# EAGLE design viewer_rev2 (EAGLE 9.0.1)
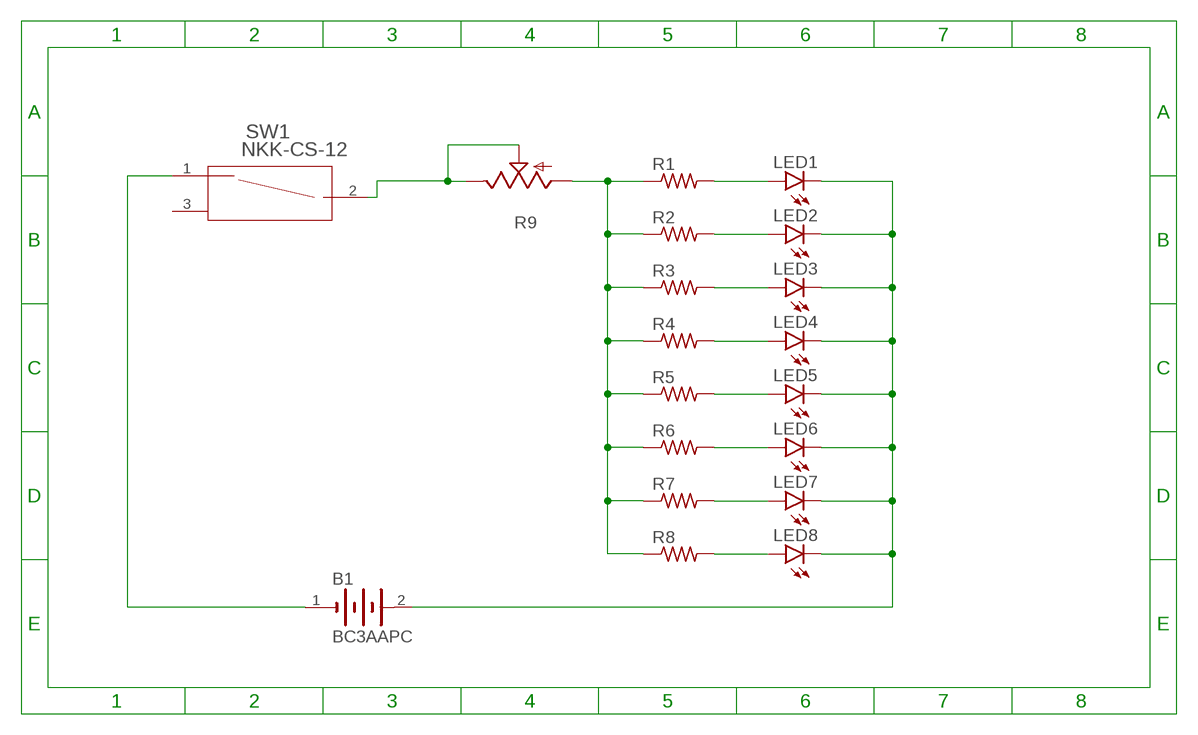
[diagram p0: schematic, sheet 1]

## Parts
B1  BC3AAPC  [BC3AAAPC]
LED1  LED5MM  [LED5MM]
LED2  LED5MM  [LED5MM]
LED3  LED5MM  [LED5MM]
LED4  LED5MM  [LED5MM]
LED5  LED5MM  [LED5MM]
LED6  LED5MM  [LED5MM]
LED7  LED5MM  [LED5MM]
LED8  LED5MM  [LED5MM]
R1  R-US_VMTB60  [VMTB60]
R2  R-US_VMTB60  [VMTB60]
R3  R-US_VMTB60  [VMTB60]
R4  R-US_VMTB60  [VMTB60]
R5  R-US_VMTB60  [VMTB60]
R6  R-US_VMTB60  [VMTB60]
R7  R-US_VMTB60  [VMTB60]
R8  R-US_VMTB60  [VMTB60]
R9  TRIM_US-CT6  [CT6]
SW1  NKK-CS-12  [SW3-SLIDE-2POL_P185]

## Nets
N$1: B1.1(-) SW1.1
N$2: R1.1 R2.1 R3.1 R4.1 R5.1 R6.1 R7.1 R8.1 R9.A
N$3: R9.E R9.S SW1.2
N$5: LED8.A R8.2
N$6: LED7.A R7.2
N$7: LED6.A R6.2
N$8: LED5.A R5.2
N$9: LED4.A R4.2
N$10: LED3.A R3.2
N$11: LED2.A R2.2
N$12: LED1.A R1.2
N$13: B1.2(+) LED1.K(C) LED2.K(C) LED3.K(C) LED4.K(C) LED5.K(C) LED6.K(C) LED7.K(C) LED8.K(C)
Unconnected: SW1.3

## Library data of the parts
B1 = BobLib:BC3AAPC: 3 AAA cell battery holder
LED1-LED8 = led:LED: LED OSRAM: - CHIPLED LG R971, LG N971, LY N971, LG Q971, LY Q971, LO R971, LY R971 LH N974, LH R974 LS Q976, LO Q976, LY Q976 LO Q996 - Hyper CHIPLED LW Q18S LB Q993, LB Q99A, LB R99A - SideLED LS A670, LO A670, LY A670, LG A670, LP A670 LB A673, LV A673, LT A673, LW A673 LH A674 LY A675 LS A676, LA A676, LO A676, LY A676, LW A676 LS A679, LY A679, LG A679 - Hyper Micro SIDELED® LS Y876, LA Y876, LO Y876, LY Y876 LT Y87S - SmartLED LW L88C, LW L88S LB L89C, LB L89S, LG L890 LS L89K, LO L89K, LY L89K LS L896, LA L896, LO L896, LY L896 - TOPLED LS T670, LO T670, LY T670, LG T670, LP T670 LSG T670, LSP T670, LSY T670, LOP T670, LYG T670 LG T671, LOG T671, LSG T671 LB T673, LV T673, LT T673, LW T673 LH T674 LS T676, LA T676, LO T676, LY T676, LB T676, LH T676, LSB T676, LW T676 LB T67C, LV T67C, LT T67C, LS T67K, LO T67K, LY T67K, LW E67C LS E67B, LA E67B, LO E67B, LY E67B, LB E67C, LV E67C, LT E67C LW T67C LS T679, LY T679, LG T679 LS T770, LO T770, LY T770, LG T770, LP T770 LB T773, LV T773, LT T773, LW T773 LH T774 LS E675, LA E675, LY E675, LS T675 LS T776, LA T776, LO T776, LY T776, LB T776 LHGB T686 LT T68C, LB T68C - Hyper Mini TOPLED® LB M676 - Mini TOPLED Santana® LG M470 LS M47K, LO M47K, LY M47K Source: http://www.osram.convergy.de LUXEON: - LUMILED® LXK2-PW12-R00, LXK2-PW12-S00, LXK2-PW14-U00, LXK2-PW14-V00 LXK2-PM12-R00, LXK2-PM12-S00, LXK2-PM14-U00 LXK2-PE12-Q00, LXK2-PE12-R00, LXK2-PE12-S00, LXK2-PE14-T00, LXK2-PE14-U00 LXK2-PB12-K00, LXK2-PB12-L00, LXK2-PB12-M00, LXK2-PB14-N00, LXK2-PB14-P00, LXK2-PB14-Q00 LXK2-PR12-L00, LXK2-PR12-M00, LXK2-PR14-Q00, LXK2-PR14-R00 LXK2-PD12-Q00, LXK2-PD12-R00, LXK2-PD12-S00 LXK2-PH12-R00, LXK2-PH12-S00 LXK2-PL12-P00, LXK2-PL12-Q00, LXK2-PL12-R00 Source: www.luxeon.com KINGBRIGHT: KA-3528ASYC Source: www.kingbright.com
R1-R8 = resistor:R-US_: RESISTOR, American symbol
R9 = pot:TRIM_US-: POTENTIOMETER
SW1 = BobLib:NKK-CS-12

## Board
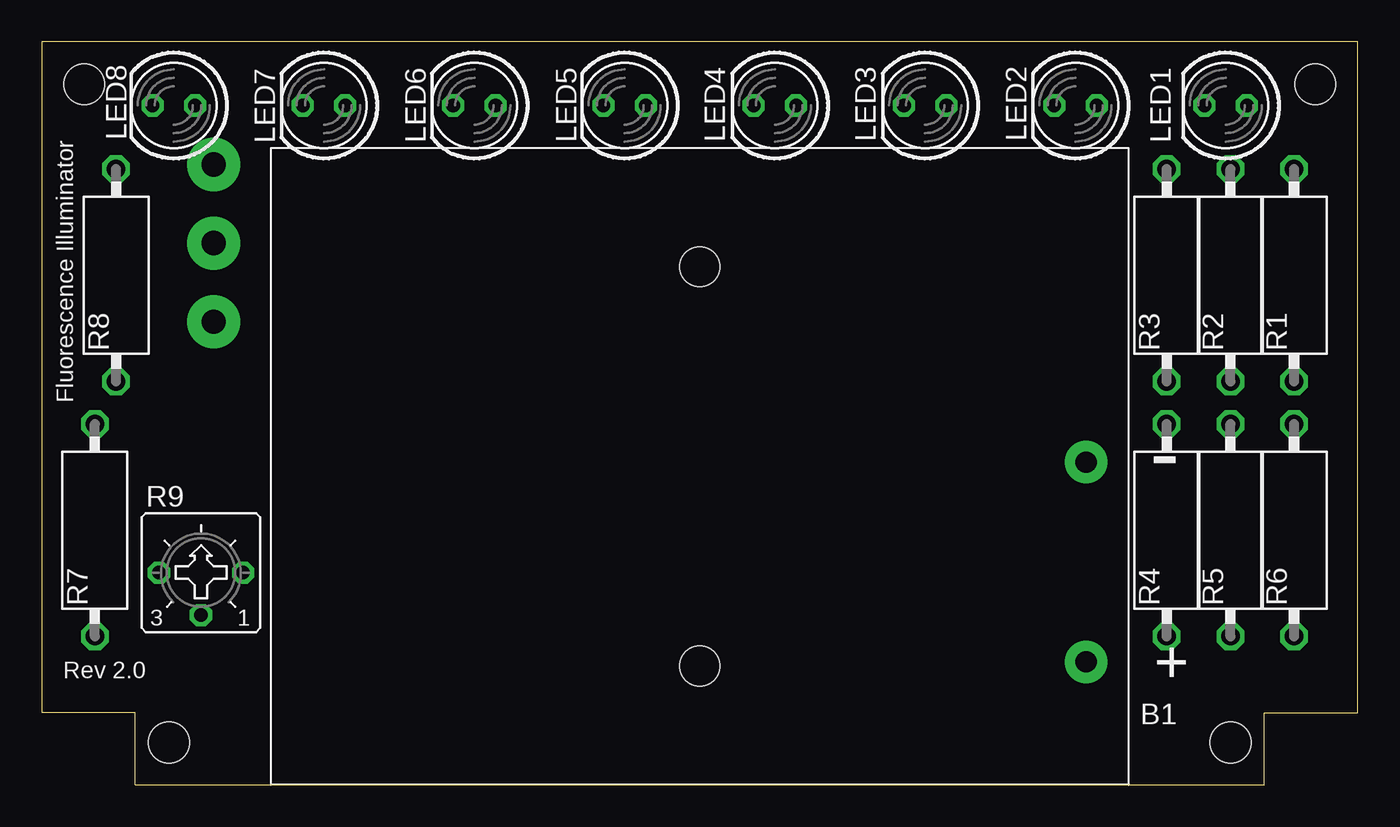
[diagram p1: board, top side]
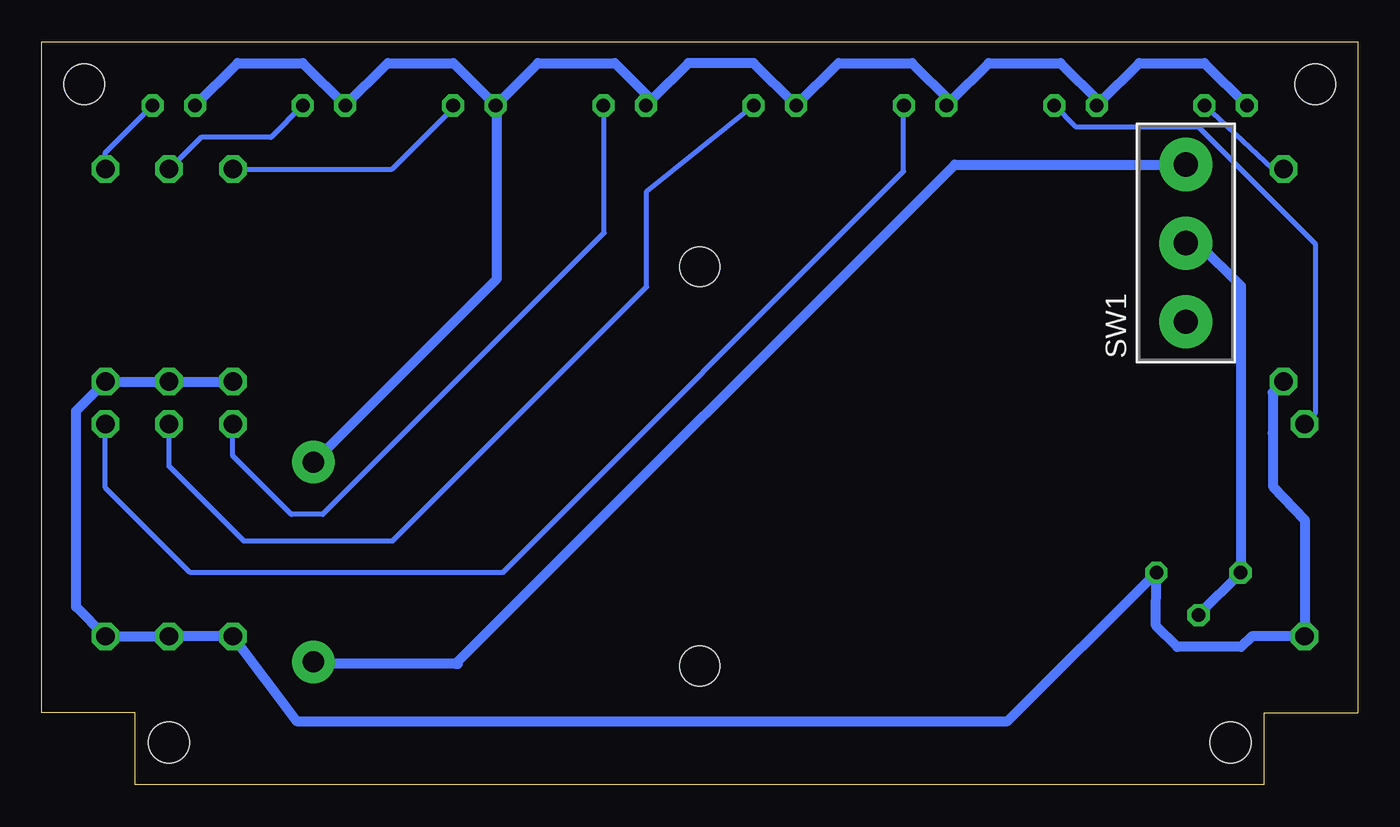
[diagram p2: board, bottom side, seen from below]

Size 78.74 x 44.45 mm. Coordinates in mm from the lower left corner, seen from the top.
Outline: 5.59,0 73.15,0 73.15,4.32 78.74,4.32 78.74,44.45 0,44.45 0,4.32 5.59,4.32 5.59,0
Copper layers (1*16): Top 0.035mm / dielectric 1.5mm / Bottom 0.035mm
Design rules "default *": minimum track width 6mil, minimum drill 0.35mm, track to track 6mil, track to pad 6mil, pad to pad 6mil, via to via 6mil, smd to smd 6mil, copper to edge 20mil, drill to drill 6mil, minimum pad ring 10mil, minimum via ring 8mil, stop-mask expansion 4mil, vias tented up to drill 0mil, thermal gap 10mil
Holes 2.44 mm at 2.54,41.91 7.62,2.54 71.12,2.54 76.2,41.91

### Footprints (pad centres in the part's own frame; a part is rotated, then mirrored left to right if it is on the bottom)
BC3AAAPC = drill 1.27 pad 2.54: 1 23.114,-11.684; 2 23.114,0.254 | hole 2.362: 0,-11.938; 0,11.938
LED5MM = drill 0.813 octagon: A -1.27,0; K 1.27,0
VMTB60 = drill 1.1 octagon: 1 -6.35,0; 2 6.35,0
CT6 = drill 0.813 octagon: A 2.515,0; E -2.515,0; S 0,-2.54
SW3-SLIDE-2POL_P185 = drill 1.448 pad 3.175: 1 -9.398,0; 2 -4.699,0; 3 0,0

### Placement (x,y rotation side)
B1  39.37,19.05 0 top
LED1  70.84,40.64 180 top
LED2  61.85,40.64 180 top
LED3  52.86,40.64 180 top
LED4  43.87,40.64 180 top
LED5  34.87,40.64 180 top
LED6  25.88,40.64 180 top
LED7  16.89,40.64 180 top
LED8  7.9,40.64 180 top
R1  74.93,30.48 90 top
R2  71.12,30.48 90 top
R3  67.31,30.48 90 top
R4  67.31,15.24 90 top
R5  71.12,15.24 90 top
R6  74.93,15.24 90 top
R7  3.17,15.24 90 top
R8  4.45,30.48 90 top
R9  9.53,12.7 0 top
SW1  10.29,27.71 270 bottom

### Tracks (layer width: path | path; a pad name or v marks a point on that pad's centre or on a via)
N$1
  Bottom 0.61: 53.85,7.24 53.98,7.24 | 53.98,7.24 62.36,7.24 B1.1 | 53.98,7.24 24.11,37.11 SW1.1
N$2
  Bottom 0.61: R3.1 R2.1 R1.1 76.68,22.38 76.68,10.64 R6.1 R5.1 R4.1 63.5,3.81 20.95,3.81 12.05,12.69 | R8.1 5.09,23.48 5.09,21.06 5.08,17.87 3.17,15.88 R7.1 6.35,8.89 6.99,8.26 10.79,8.26 12.06,9.53 12.05,12.69 | 12.05,12.69 R9.A
N$3
  Bottom 0.152: 6.99,12.72 R9.E | 9.55,32.41 9.53,32.38
  Bottom 0.61: R9.E 9.53,10.19 R9.S | 9.53,32.38 6.99,29.84 6.99,12.72 | SW1.2 9.55,32.41
N$5
  Bottom 0.305: R8.2 5.08,36.83 LED8.A
N$6
  Bottom 0.305: LED7.A 16.89,39.37 9.53,39.37 2.54,32.38 2.54,22.23 R7.2
N$7
  Bottom 0.152: 27.18,40.62 LED6.A
  Bottom 0.305: 27.18,40.62 27.18,36.7 51.18,12.7 69.85,12.7 74.93,17.78 R6.2
N$8
  Bottom 0.305: R5.2 71.12,19.05 66.67,14.61 57.73,14.61 42.55,29.79 42.55,35.51 LED5.A
N$9
  Bottom 0.152: 45.09,40.59 LED4.A
  Bottom 0.305: R4.2 67.31,19.68 63.8,16.18 61.92,16.18 45.09,33.02 45.09,40.59
N$10
  Bottom 0.152: 54.13,40.49 LED3.A
  Bottom 0.305: R3.2 57.78,36.83 54.13,40.49
N$11
  Bottom 0.305: LED2.A 65.02,38.73 69.22,38.73 R2.2
N$12
  Bottom 0.305: R1.2 74.93,37.82 LED1.A
N$13
  Bottom 0.152: LED7.K 15.43,40.83 | LED6.K 24.37,40.88 | 42.25,40.98 LED4.K | 51.51,40.72 LED3.K 51.59,40.66
  Bottom 0.61: LED8.K 9.17,43.18 13.08,43.18 15.43,40.83 17.78,43.18 22.07,43.18 24.37,40.88 26.67,43.18 31.06,43.18 LED5.K 36.14,43.18 40.06,43.18 42.25,40.98 44.45,43.18 49.05,43.18 51.51,40.72 51.51,30.28 B1.2 | 51.59,40.66 54.1,43.18 58.04,43.18 LED2.K 63.12,43.18 67.03,43.18 LED1.K

### Text on the board
tPlace: Fluorescence Illuminator | Rev 2.0